# EAGLE design Ex Alligator (EAGLE 7.6.0)
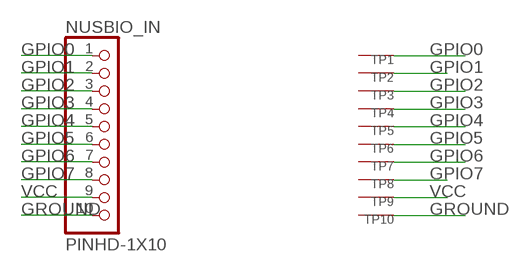
[diagram p0: schematic, sheet 1]

## Parts
NUSBIO_IN  PINHD-1X10  [1X10-BIG]
TP1  SEWTAPBIG  [BIGTAP]
TP2  SEWTAPBIG  [BIGTAP]
TP3  SEWTAPBIG  [BIGTAP]
TP4  SEWTAPBIG  [BIGTAP]
TP5  SEWTAPBIG  [BIGTAP]
TP6  SEWTAPBIG  [BIGTAP]
TP7  SEWTAPBIG  [BIGTAP]
TP8  SEWTAPBIG  [BIGTAP]
TP9  SEWTAPBIG  [BIGTAP]
TP10  SEWTAPBIG  [BIGTAP]

## Nets
GPIO0: NUSBIO_IN.1 TP1.P$1(SEW)
GPIO1: NUSBIO_IN.2 TP2.P$1(SEW)
GPIO2: NUSBIO_IN.3 TP3.P$1(SEW)
GPIO3: NUSBIO_IN.4 TP4.P$1(SEW)
GPIO4: NUSBIO_IN.5 TP5.P$1(SEW)
GPIO5: NUSBIO_IN.6 TP6.P$1(SEW)
GPIO6: NUSBIO_IN.7 TP7.P$1(SEW)
GPIO7: NUSBIO_IN.8 TP8.P$1(SEW)
GROUND: NUSBIO_IN.10 TP10.P$1(SEW)
VCC: NUSBIO_IN.9 TP9.P$1(SEW)

## Library data of the parts
NUSBIO_IN = adafruit:PINHD-1X10: Pin header 1x10 0.1" spacing With round pins
TP1-TP10 = adafruit:SEWTAP

## Board
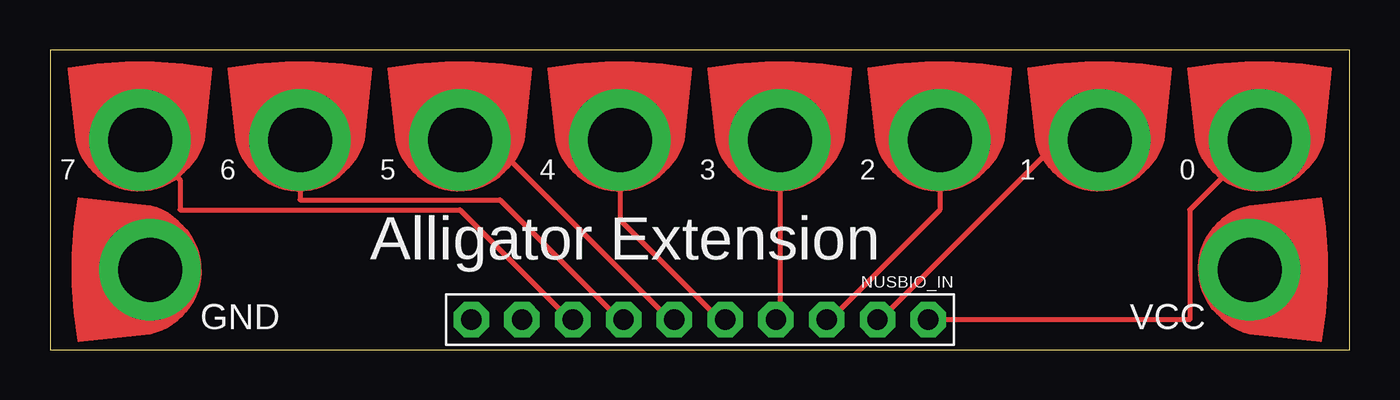
[diagram p1: board, top side]
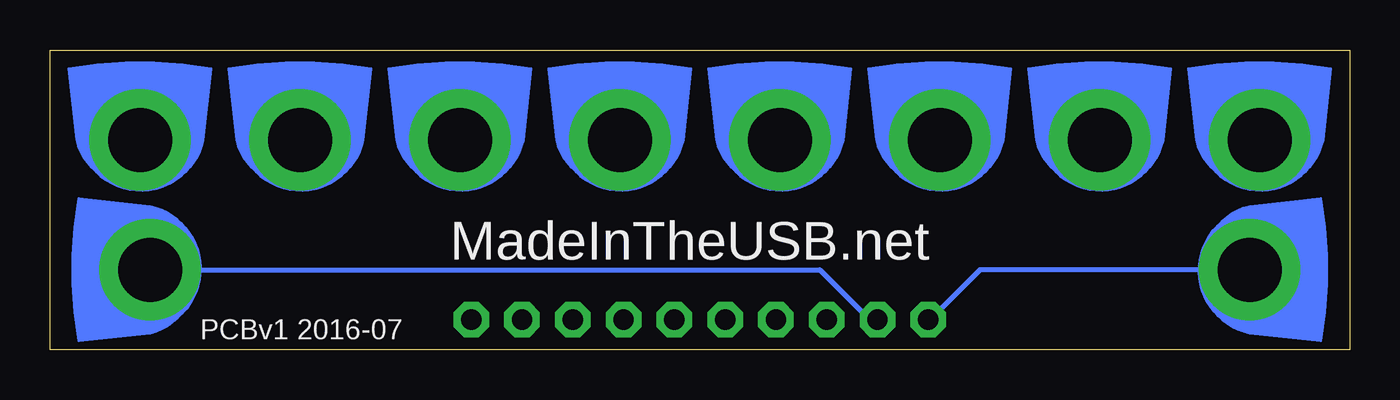
[diagram p2: board, bottom side, seen from below]

Size 65 x 15 mm. Coordinates in mm from the lower left corner, seen from the top.
Outline: 0,0 65,0 65,15 0,15 0,0
Copper layers (1*16): Top 0.035mm / dielectric 1.5mm / Bottom 0.035mm
Design rules "default": minimum track width 10mil, minimum drill 24mil, track to track 8mil, track to pad 8mil, pad to pad 8mil, via to via 8mil, smd to smd 8mil, copper to edge 40mil, drill to drill 8mil, minimum pad ring 10mil, minimum via ring 8mil, stop-mask expansion 4mil, vias tented up to drill 0mil, thermal gap 10mil

### Footprints (pad centres in the part's own frame; a part is rotated, then mirrored left to right if it is on the bottom)
1X10-BIG = drill 1.016 pad 1.778 octagon: 1 -11.43,0; 2 -8.89,0; 3 -6.35,0; 4 -3.81,0; 5 -1.27,0; 6 1.27,0; 7 3.81,0; 8 6.35,0; 9 8.89,0; 10 11.43,0
BIGTAP = drill 3.2 pad 5.08: P$1 0,0

### Placement (x,y rotation side)
NUSBIO_IN  32.5,1.5 180 top
TP1  60.5,10.5 0 top
TP2  52.5,10.5 0 top
TP3  44.5,10.5 0 top
TP4  36.5,10.5 0 top
TP5  28.5,10.5 0 top
TP6  20.5,10.5 0 top
TP7  12.5,10.5 0 top
TP8  4.5,10.5 0 top
TP9  60,4 270 top
TP10  5,4 90 top

### Tracks (layer width: path | path; a pad name or v marks a point on that pad's centre or on a via)
GPIO0
  Top 0.254: NUSBIO_IN.1 57,1.5 57,7 TP1.P$1
GPIO1
  Top 0.254: TP2.P$1 50.5,10.5 41.5,1.5 NUSBIO_IN.2
GPIO2
  Top 0.254: TP3.P$1 44.5,7 39,1.5 NUSBIO_IN.3
GPIO3
  Top 0.254: TP4.P$1 36.5,1.5 NUSBIO_IN.4
GPIO4
  Top 0.254: TP5.P$1 28.5,6.5 33.5,1.5 NUSBIO_IN.5
GPIO5
  Top 0.254: TP6.P$1 22,10.5 31,1.5 NUSBIO_IN.6
GPIO6
  Top 0.254: TP7.P$1 12.5,7.5 22.5,7.5 28.5,1.5 NUSBIO_IN.7
GPIO7
  Top 0.254: TP8.P$1 6.5,8.5 6.5,7 20.5,7 26,1.5 NUSBIO_IN.8
GROUND
  Bottom 0.254: TP10.P$1 18.5,4 21,1.5 NUSBIO_IN.10
VCC
  Bottom 0.254: TP9.P$1 26.5,4 24,1.5 NUSBIO_IN.9

### Text on the board
tNames: 7 | 6 | 5 | 4 | 3 | 2 | 1 | 0 | Alligator Extension | GND | VCC
bNames: MadeInTheUSB.net | PCBv1 2016-07